# EAGLE schematic shift register serial (EAGLE 6.4)
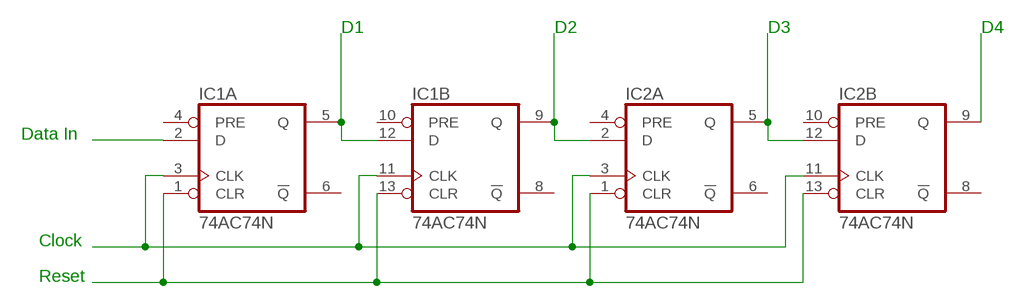
[diagram p0: schematic, sheet 1]

## Parts
IC1  74AC74N  [DIL14]
IC2  74AC74N  [DIL14]

## Nets
CLOCK: IC1.3(A:CLK) IC1.11(B:CLK) IC2.3(A:CLK) IC2.11(B:CLK)
N$1: IC1.5(A:Q) IC1.12(B:D)
N$2: IC1.9(B:Q) IC2.2(A:D)
N$3: IC2.5(A:Q) IC2.12(B:D)
N$4: IC1.2(A:D)
N$5: IC2.9(B:Q)
N$6: IC1.1(A:CLR) IC1.13(B:CLR) IC2.1(A:CLR) IC2.13(B:CLR)
Unconnected: IC1.4(A:PRE) IC1.6(A:!Q) IC1.8(B:!Q) IC1.10(B:PRE) IC2.4(A:PRE) IC2.6(A:!Q) IC2.8(B:!Q) IC2.10(B:PRE)

## Notes on the sheet
- D1 | D2 | D3 | D4
- Data In
- Clock
- Reset

## Power pins joined to a net without a drawn wire
GND: IC1.7(P:GND) IC2.7(P:GND)
VCC: IC1.14(P:VCC) IC2.14(P:VCC)

## Library data of the parts
IC1 IC2 = 74xx-eu:74*74: Dual D type positive edge triggered FLIP FLOP, preset and clear